# Altium schematic sheet LTC2325.SchDoc
size A4
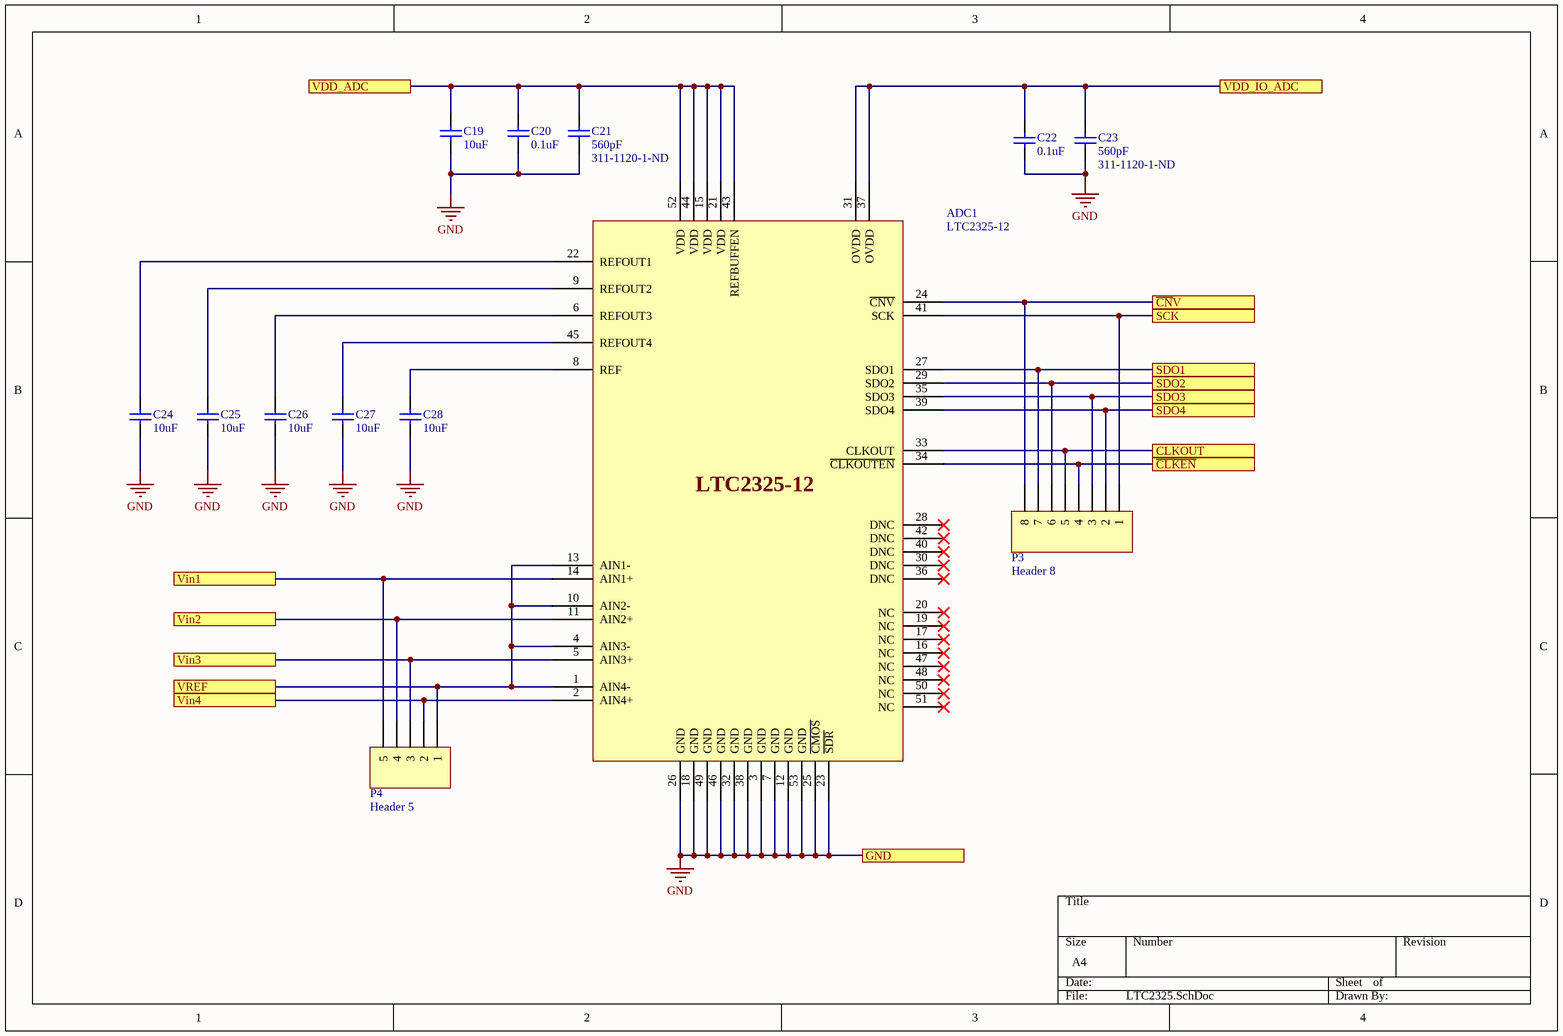
[diagram p0: LTC2325.SchDoc]

## Parts
ADC1  LTC2325-12  [LTC2320HUKG]
C19  10uF  [C0805]
C20  0.1uF  [C0805]
C21  560pF  Supplier Part Number 1: 311-1120-1-ND  [C0805]
C22  0.1uF  [C0805]
C23  560pF  Supplier Part Number 1: 311-1120-1-ND  [C0805]
C24  10uF  [C0805]
C25  10uF  [C0805]
C26  10uF  [C0805]
C27  10uF  [C0805]
C28  10uF  [C0805]
P3  Header 8  [HDR1X8]
P4  Header 5  [HDR1X5]

## Ports
CLKOUT, GND, SCK, SDO1, SDO2, SDO3, SDO4, VDD_ADC, VDD_IO_ADC, Vin1, Vin2, Vin3, Vin4, VREF, ~{CLKEN}, ~{CN}V

## Nets
GND: ADC1.3(GND) ADC1.7(GND) ADC1.12(GND) ADC1.18(GND) ADC1.23(~{SDR}) ADC1.25(~{CMOS}) ADC1.26(GND) ADC1.32(GND) ADC1.38(GND) ADC1.46(GND) ADC1.49(GND) ADC1.53(GND) C19.1 C20.1 C21.1 C22.1 C23.1 C24.1 C25.1 C26.1 C27.1 C28.1 ; port GND
~{CLKEN}: ADC1.34(~{CLKOUTEN}) P3.4 ; port ~{CLKEN}
~{CN}V: ADC1.24(~{CNV}) P3.8 ; port ~{CN}V
CLKOUT: ADC1.33(CLKOUT) P3.5 ; port CLKOUT
SCK: ADC1.41(SCK) P3.1 ; port SCK
SDO1: ADC1.27(SDO1) P3.7 ; port SDO1
SDO2: ADC1.29(SDO2) P3.6 ; port SDO2
SDO3: ADC1.35(SDO3) P3.3 ; port SDO3
SDO4: ADC1.39(SDO4) P3.2 ; port SDO4
VDD_ADC: ADC1.15(VDD) ADC1.21(VDD) ADC1.43(REFBUFFEN) ADC1.44(VDD) ADC1.52(VDD) C19.2 C20.2 C21.2 ; port VDD_ADC
VDD_IO_ADC: ADC1.31(OVDD) ADC1.37(OVDD) C22.2 C23.2 ; port VDD_IO_ADC
Vin1: ADC1.14(AIN1+) P4.5 ; port Vin1
Vin2: ADC1.11(AIN2+) P4.4 ; port Vin2
Vin3: ADC1.5(AIN3+) P4.3 ; port Vin3
Vin4: ADC1.2(AIN4+) P4.2 ; port Vin4
VREF: ADC1.1(AIN4-) ADC1.4(AIN3-) ADC1.10(AIN2-) ADC1.13(AIN1-) P4.1 ; port VREF
NetADC1_6: ADC1.6(REFOUT3) C26.2
NetADC1_8: ADC1.8(REF) C28.2
NetADC1_9: ADC1.9(REFOUT2) C25.2
NetADC1_22: ADC1.22(REFOUT1) C24.2
NetADC1_45: ADC1.45(REFOUT4) C27.2

Not connected (* = marked no-connect by the designer): ADC1 16(NC)* 17(NC)* 19(NC)* 20(NC)* 28(DNC)* 30(DNC)* 36(DNC)* 40(DNC)* 42(DNC)* 47(NC)* 48(NC)* 50(NC)* 51(NC)*

## Library data of the parts
ADC1 = LTC2325-12: Quad, 12-Bit, 5Msps/Ch Simultaneous Sampling ADC
C19 C24-C28 = Cap 10uF: Manufacturer: Taiyo Yuden; Manufacturer Part Number: UMK212SD103KD-T; Dielectric Material: Ceramic; Capacitance: 10nF; Tolerance: 10%; Voltage Rating: 50V; Supplier 1: Digi-Key; Stock 1: 14125; Pricing 1: 1=0.47, 10=0.323, 100=0.1941, 500=0.1455, 1000=0.1229 (USD); Mount: Surface Mount; Case/Package: 0805; Number of Pins: 2; Case Code (Metric): 2012; Case Code (Imperial): 0805; Min Operating Temperature: -55°C; Max Operating Temperature: 125°C; Packaging: Tape and Reel; Package Quantity: 1; Voltage Rating (DC): 50V; Termination: SMD/SMT; Length: 2mm; Height: 0.85mm; Width: 0.049inch; Thickness: 0.037inch; Depth: 1.25mm; Radiation Hardening: No; Lead Free: Lead Free; Halogen Free: Halogen Free; ComponentLink1URL: https://datasheet.ciiva.com/138/umk212sd103kd-t-ss-138661.pdf; ComponentLink1Description: https://datasheet.ciiva.com/138/umk212sd103kd-t-ss-138661.pdf; ComponentLink2URL: https://datasheet.ciiva.com/138/mlcc07-e-138662.pdf; ComponentLink2Description: https://datasheet.ciiva.com/138/mlcc07-e-138662.pdf; ComponentLink3URL: https://datasheet.ciiva.com/138/mlcc07-e-138663.pdf; ComponentLink3Description: https://datasheet.ciiva.com/138/mlcc07-e-138663.pdf; ComponentLink4URL: https://datasheet.ciiva.com/30140/303umk212sd103kd-t-30140925.pdf; ComponentLink4Description: https://datasheet.ciiva.com/30140/303umk212sd103kd-t-30140925.pdf; Supplier Part Number 1: 587-1114-1-ND
C20 C22 = Cap 0.1uF: Manufacturer: Taiyo Yuden; Manufacturer Part Number: UMK212SD103KD-T; Dielectric Material: Ceramic; Capacitance: 10nF; Tolerance: 10%; Voltage Rating: 50V; Supplier 1: Digi-Key; Stock 1: 14125; Pricing 1: 1=0.47, 10=0.323, 100=0.1941, 500=0.1455, 1000=0.1229 (USD); Mount: Surface Mount; Case/Package: 0805; Number of Pins: 2; Case Code (Metric): 2012; Case Code (Imperial): 0805; Min Operating Temperature: -55°C; Max Operating Temperature: 125°C; Packaging: Tape and Reel; Package Quantity: 1; Voltage Rating (DC): 50V; Termination: SMD/SMT; Length: 2mm; Height: 0.85mm; Width: 0.049inch; Thickness: 0.037inch; Depth: 1.25mm; Radiation Hardening: No; Lead Free: Lead Free; Halogen Free: Halogen Free; ComponentLink1URL: https://datasheet.ciiva.com/138/umk212sd103kd-t-ss-138661.pdf; ComponentLink1Description: https://datasheet.ciiva.com/138/umk212sd103kd-t-ss-138661.pdf; ComponentLink2URL: https://datasheet.ciiva.com/138/mlcc07-e-138662.pdf; ComponentLink2Description: https://datasheet.ciiva.com/138/mlcc07-e-138662.pdf; ComponentLink3URL: https://datasheet.ciiva.com/138/mlcc07-e-138663.pdf; ComponentLink3Description: https://datasheet.ciiva.com/138/mlcc07-e-138663.pdf; ComponentLink4URL: https://datasheet.ciiva.com/30140/303umk212sd103kd-t-30140925.pdf; ComponentLink4Description: https://datasheet.ciiva.com/30140/303umk212sd103kd-t-30140925.pdf; Supplier Part Number 1: 587-1114-1-ND
C21 C23 = Cap 560pF: Manufacturer: Taiyo Yuden; Manufacturer Part Number: UMK212SD103KD-T; Dielectric Material: Ceramic; Capacitance: 10nF; Tolerance: 10%; Voltage Rating: 50V; Stock 1: 14125; Pricing 1: 1=0.47, 10=0.323, 100=0.1941, 500=0.1455, 1000=0.1229 (USD); Mount: Surface Mount; Case/Package: 0805; Number of Pins: 2; Case Code (Metric): 2012; Case Code (Imperial): 0805; Min Operating Temperature: -55°C; Max Operating Temperature: 125°C; Packaging: Tape and Reel; Package Quantity: 1; Voltage Rating (DC): 50V; Termination: SMD/SMT; Length: 2mm; Height: 0.85mm; Width: 0.049inch; Thickness: 0.037inch; Depth: 1.25mm; Radiation Hardening: No; Lead Free: Lead Free; Halogen Free: Halogen Free; ComponentLink1URL: https://datasheet.ciiva.com/138/umk212sd103kd-t-ss-138661.pdf; ComponentLink1Description: https://datasheet.ciiva.com/138/umk212sd103kd-t-ss-138661.pdf; ComponentLink2URL: https://datasheet.ciiva.com/138/mlcc07-e-138662.pdf; ComponentLink2Description: https://datasheet.ciiva.com/138/mlcc07-e-138662.pdf; ComponentLink3URL: https://datasheet.ciiva.com/138/mlcc07-e-138663.pdf; ComponentLink3Description: https://datasheet.ciiva.com/138/mlcc07-e-138663.pdf; ComponentLink4URL: https://datasheet.ciiva.com/30140/303umk212sd103kd-t-30140925.pdf; ComponentLink4Description: https://datasheet.ciiva.com/30140/303umk212sd103kd-t-30140925.pdf; Supplier 1: Digi-Key
P3 = Header 8: Header, 8-Pin; LatestRevisionDate: 17-Jul-2002; LatestRevisionNote: Re-released for DXP Platform.; Publisher: Altium Limited
P4 = Header 5: Header, 5-Pin; LatestRevisionDate: 17-Jul-2002; LatestRevisionNote: Re-released for DXP Platform.; Publisher: Altium Limited